# Altium project bolid.PrjPcb (part 1 of 6)
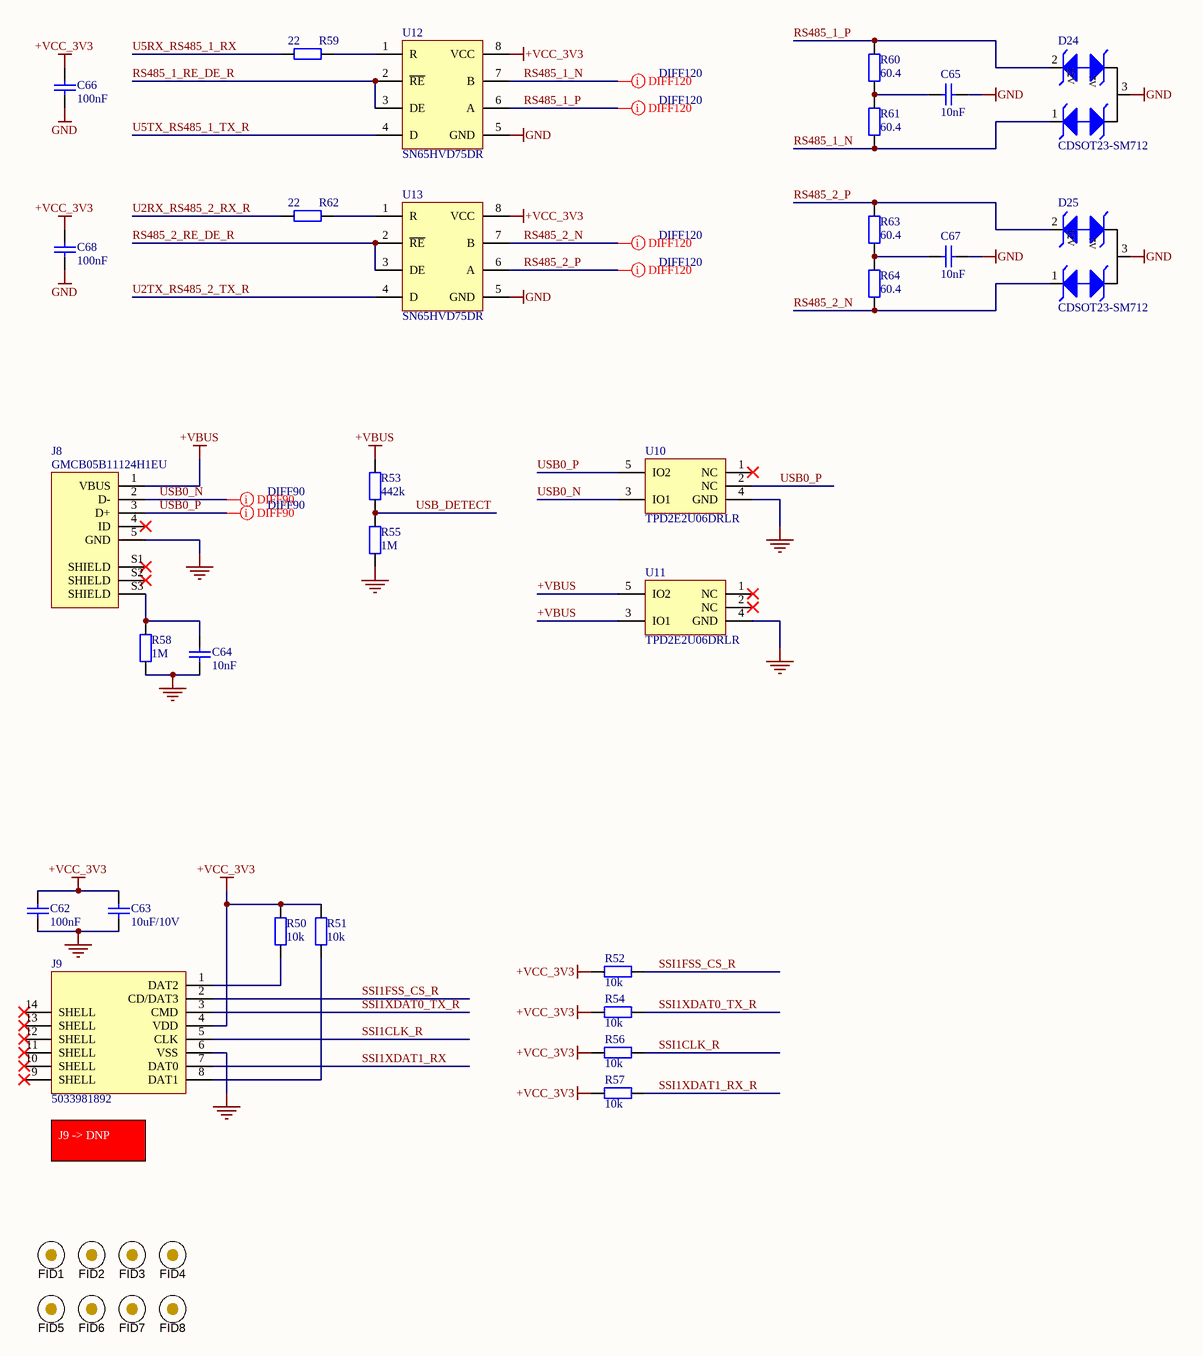
[diagram p0: bolid-rs485-usb-sd.SchDoc]
11 sheets, 459 parts. Net scope: global (net labels, ports and power ports of the same name join across sheets).
Board file: bolid.PcbDoc
Sheets:
  bolid-rs485-usb-sd.SchDoc
  bolid-inputs-lv.SchDoc
  bolid-inputs-digital.SchDoc
  bolid-inputs-hv.SchDoc
  bolid-outputs.SchDoc
  bolid-power-dcdc-ldo.SchDoc
  bolid-power-input.SchDoc
  bolid-iso-protium.SchDoc
  bolid-iso-motor-control.SchDoc
  bolid-mcu.SchDoc
  bolid-nets.SchDoc

## Sheet bolid-rs485-usb-sd.SchDoc
size A3

### Parts
C62  Value Displayed: 100nF  [C0402-CAPC100X50X55L22 - Tayio Yuden TDK]  (hidden comment: GRM155R71H104KE14D)
C63  Value Displayed: 10uF/10V  [C0805-CAPC200X125X135L50N - Taiyo YudenN]  (hidden comment: GRM21BR71A106KA73K)
C64  Value Displayed: 10nF  [C0402-CAPC100X50X55L22 - Tayio Yuden TDK]  (hidden comment: GCM155R71H103KA55D)
C65  Value Displayed: 10nF  [C0402-CAPC100X50X55L22 - Tayio Yuden TDK]  (hidden comment: GCM155R71H103KA55D)
C66  Value Displayed: 100nF  [C0402-CAPC100X50X55L22 - Tayio Yuden TDK]  (hidden comment: GRM155R71H104KE14D)
C67  Value Displayed: 10nF  [C0402-CAPC100X50X55L22 - Tayio Yuden TDK]  (hidden comment: GCM155R71H103KA55D)
C68  Value Displayed: 100nF  [C0402-CAPC100X50X55L22 - Tayio Yuden TDK]  (hidden comment: GRM155R71H104KE14D)
D24  CDSOT23-SM712  [Bourns SOT-23-3L SOT23-3P95_229X117L49X40N]
D25  CDSOT23-SM712  [Bourns SOT-23-3L SOT23-3P95_229X117L49X40N]
FID1  Fiducial  [Fiducial10-20]  (value not drawn)  (no BOM)
FID2  Fiducial  [Fiducial10-20]  (value not drawn)  (no BOM)
FID3  Fiducial  [Fiducial10-20]  (value not drawn)  (no BOM)
FID4  Fiducial  [Fiducial10-20]  (value not drawn)  (no BOM)
FID5  Fiducial  [Fiducial10-20]  (value not drawn)  (no BOM)
FID6  Fiducial  [Fiducial10-20]  (value not drawn)  (no BOM)
FID7  Fiducial  [Fiducial10-20]  (value not drawn)  (no BOM)
FID8  Fiducial  [Fiducial10-20]  (value not drawn)  (no BOM)
J8  GMCB05B11124H1EU  [AMPHENOL-GMCB05B11124H1EU]
J9  5033981892  [MOLEX MICROSD 5033981892]
R50  value 10k  [R0402-RESC100X50X40L22N]  (hidden comment: RC0402FR-0710KL)
R51  value 10k  [R0402-RESC100X50X40L22N]  (hidden comment: RC0402FR-0710KL)
R52  value 10k  [R0402-RESC100X50X40L22N]  (hidden comment: RC0402FR-0710KL)
R53  value 442k  [R0402-RESC100X50X40L22N]  (hidden comment: ERJ-2RKF4423X)
R54  value 10k  [R0402-RESC100X50X40L22N]  (hidden comment: RC0402FR-0710KL)
R55  value 1M  [R0402-RESC100X50X40L22N]  (hidden comment: AC0402FR-071ML)
R56  value 10k  [R0402-RESC100X50X40L22N]  (hidden comment: RC0402FR-0710KL)
R57  value 10k  [R0402-RESC100X50X40L22N]  (hidden comment: RC0402FR-0710KL)
R58  value 1M  [R0402-RESC100X50X40L22N]  (hidden comment: AC0402FR-071ML)
R59  value 22  [R0402-RESC100X50X40L22N]  (hidden comment: RC0402FR-1322RL)
R60  value 60.4  [R0603-RESC160X80X55L30N]  (hidden comment: RC0603FR-0760R4L)
R61  value 60.4  [R0603-RESC160X80X55L30N]  (hidden comment: RC0603FR-0760R4L)
R62  value 22  [R0402-RESC100X50X40L22N]  (hidden comment: RC0402FR-1322RL)
R63  value 60.4  [R0603-RESC160X80X55L30N]  (hidden comment: RC0603FR-0760R4L)
R64  value 60.4  [R0603-RESC160X80X55L30N]  (hidden comment: RC0603FR-0760R4L)
U10  TPD2E2U06DRLR  [TI SOT-5X3 DRL0005A SOTFL50P160X60-5N]
U11  TPD2E2U06DRLR  [TI SOT-5X3 DRL0005A SOTFL50P160X60-5N]
U12  SN65HVD75DR  [TI SOIC8 D0008A SOIC8P127_490X599X175L84X41N]
U13  SN65HVD75DR  [TI SOIC8 D0008A SOIC8P127_490X599X175L84X41N]

### Nets
+VBUS: J8.1(VBUS) R53.2 U11.3(IO1) U11.5(IO2)
+VCC_3V3: C62.2 C63.1 C66.1 C68.1 J9.4(VDD) R50.1 R51.1 R52.1 R54.1 R56.1 R57.1 U12.8(VCC) U13.8(VCC)
GND: C62.1 C63.2 C64.1 C65.2 C66.2 C67.2 C68.2 D24.3 D25.3 J8.5(GND) J9.6(VSS) R55.1 R58.1 U10.4(GND) U11.4(GND) U12.5(GND) U13.5(GND)
RS485_1_N: D24.1 R61.1 U12.7(B)
RS485_1_P: D24.2 R60.2 U12.6(A)
RS485_1_RE_DE_R: U12.2(~{RE}) U12.3(DE)
RS485_2_N: D25.1 R64.1 U13.7(B)
RS485_2_P: D25.2 R63.2 U13.6(A)
RS485_2_RE_DE_R: U13.2(~{RE}) U13.3(DE)
SSI1CLK_R: J9.5(CLK) R56.2
SSI1FSS_CS_R: J9.2(CD/DAT3) R52.2
SSI1XDAT0_TX_R: J9.3(CMD) R54.2
SSI1XDAT1_RX: J9.7(DAT0)
SSI1XDAT1_RX_R: R57.2
U2RX_RS485_2_RX_R: R62.1
U2TX_RS485_2_TX_R: U13.4(D)
U5RX_RS485_1_RX: R59.1
U5TX_RS485_1_TX_R: U12.4(D)
USB0_N: J8.2(D-) U10.3(IO1)
USB0_P: J8.3(D+) U10.2(NC) U10.5(IO2)
USB_DETECT: R53.1 R55.2
NetC64_2: C64.2 J8.S3(SHIELD) R58.2
NetC65_1: C65.1 R60.1 R61.2
NetC67_1: C67.1 R63.1 R64.2
NetJ9_1: J9.1(DAT2) R50.2
NetJ9_8: J9.8(DAT1) R51.2
NetR59_2: R59.2 U12.1(R)
NetR62_2: R62.2 U13.1(R)

Not connected (* = marked no-connect by the designer): FID1 X; FID2 X; FID3 X; FID4 X; FID5 X; FID6 X; FID7 X; FID8 X; J8 4(ID)* S1(SHIELD)* S2(SHIELD)*; J9 9(SHELL)* 10(SHELL)* 11(SHELL)* 12(SHELL)* 13(SHELL)* 14(SHELL)*; U10 1(NC)*; U11 1(NC)* 2(NC)*

### Layout directives
differential pair; differential pair class DIFF120: RS485_1_N, RS485_1_P, RS485_2_N, RS485_2_P
differential pair; differential pair class DIFF90: USB0_N, USB0_P

### Notes on the sheet
- (near J9) J9 -> DNP
- (in symbol CDSOT23-SM712) 7V

### Library data of the parts
C62 C66 C68 = GRM155R71H104KE14D: MLCC 0402 (1005) 100nF 10% 50V X7R; Manufacturer: Murata Electronics; Capacitance: 0.1 uF; Type: Chip Multilayer Ceramic Capacitor for General Purpose; Voltage Rating DC: 50 VDC; Capacitance - pF: 100000 pF; Class: Class 2; Supplier 1: Mouser; Manufacturer Part Number: GRM155R71H104KE14D; RoHS: RoHS Compliant; Category: Multilayer Ceramic Capacitors MLCC - SMD/SMT; Stock 1: 3511637; Pricing 1: 1=0.090, 10=0.038, 100=0.016, 500=0.012, 1000=0.009, 2500=0.008, 5000=0.007, 10000=0.005 (EUR); Height: 0.5 mm; Length: 1 mm; Package / Case: 0402 (1005 metric); Packaging: Cut Tape; Product: General Type MLCCs; Series: GRM; Termination Style: SMD/SMT; Tolerance: 10 %; Width: 0.5 mm; Brand: Murata Electronics; Capacitance - nF: 100 nF; Case Code - in: 0402; Case Code - mm: 1005; Dielectric: X7R; Maximum Operating Temperature: + 125 C; Minimum Operating Temperature: - 55 C; Product Type: Ceramic Capacitors; Standard Pack Qty: 10000; Subcategory: Capacitors; Termination: Standard; RoHS - Mouser: Y; Minimum Order Quantity: 1; Reeling: True; ComponentLink1URL: https://www.mouser.com/datasheet/2/281/murata_03052018_GRM_Series_1-1310166.pdf; ComponentLink1Description: https://www.mouser.com/datasheet/2/281/murata_03052018_GRM_Series_1-1310166.pdf; Value: 100nF; Supplier Part Number 1: 81-GRM155R71H104KE4D
C63 = GRM21BR71A106KA73K: MLCC 0805 (2012) 10uF 10% 10V X7R; Manufacturer: Murata Electronics; Type: Chip Multilayer Ceramic Capacitor for General Purpose; Voltage Rating DC: 10 VDC; Class: Class 2; Value: 10u; Supplier 1: Mouser; Manufacturer Part Number: GRM21BR71A106KA73K; RoHS: RoHS Compliant; Category: Multilayer Ceramic Capacitors MLCC - SMD/SMT; Stock 1: 108729; Pricing 1: 1=0.207, 10=0.144, 100=0.072, 500=0.050, 1000=0.043, 2500=0.040, 5000=0.036, 10000=0.030, 20000=0.028 (EUR); Capacitance: 10 uF; Height: 1.25 mm; Length: 2 mm; Package / Case: 0805 (2012 metric); Packaging: Cut Tape; Product: General Type MLCCs; Series: GRM; Termination Style: SMD/SMT; Tolerance: 10 %; Width: 1.25 mm; Brand: Murata Electronics; Case Code - in: 0805; Case Code - mm: 2012; Dielectric: X7R; Maximum Operating Temperature: + 125 C; Minimum Operating Temperature: - 55 C; Product Type: Ceramic Capacitors; Standard Pack Qty: 10000; Subcategory: Capacitors; Termination: Standard; RoHS - Mouser: Y; Minimum Order Quantity: 1; Reeling: True; ComponentLink1URL: https://www.mouser.com/datasheet/2/281/murata_03052018_GRM_Series_1-1310166.pdf; ComponentLink1Description: https://www.mouser.com/datasheet/2/281/murata_03052018_GRM_Series_1-1310166.pdf; Supplier Part Number 1: 81-GRM21BR71A106KA3K
C64 C65 C67 = GCM155R71H103KA55D: MLCC 0402 (1005) 10nF 10% 50V X7R; Manufacturer: Murata Electronics; Capacitance: 0.01 uF; Type: Chip Multilayer Ceramic Capacitors for Automotive; Voltage Rating DC: 50 VDC; Capacitance - pF: 10000 pF; Class: Class 2; Qualification: AEC-Q200; Value: 10n; Supplier 1: Mouser; Manufacturer Part Number: GCM155R71H103KA55D; RoHS: RoHS Compliant; Category: Multilayer Ceramic Capacitors MLCC - SMD/SMT; Stock 1: 7174893; Pricing 1: 1=0.090, 10=0.033, 100=0.015, 500=0.011, 1000=0.009, 2500=0.008, 5000=0.006, 10000=0.005, 20000=0.004 (EUR); Height: 0.5 mm; Length: 1 mm; Package / Case: 0402 (1005 metric); Packaging: Cut Tape; Product: Automotive MLCCs; Series: GCM; Termination Style: SMD/SMT; Tolerance: 10 %; Width: 0.5 mm; Brand: Murata Electronics; Capacitance - nF: 10 nF; Case Code - in: 0402; Case Code - mm: 1005; Dielectric: X7R; Maximum Operating Temperature: + 125 C; Minimum Operating Temperature: - 55 C; Product Type: Ceramic Capacitors; Standard Pack Qty: 10000; Subcategory: Capacitors; Termination: Standard; RoHS - Mouser: Y; Minimum Order Quantity: 1; Reeling: True; ComponentLink1URL: https://www.mouser.com/datasheet/2/281/murata_03122018_GCM_Series-1310150.pdf; ComponentLink1Description: https://www.mouser.com/datasheet/2/281/murata_03122018_GCM_Series-1310150.pdf; Supplier Part Number 1: 81-GCM155R71H103KA5D
D24 D25 = CDSOT23-SM712: TVS DIODE 7VWM/12VWM SOT23; Manufacturer: Bourns; Direction: Bidirectional; Capacitance: 75pF; Max Surge Current: 30A; Number of Elements: 2; Reverse Breakdown Voltage: 13.3V; Polarity: Bidirectional,Unidirectional; Clamping Voltage: 19V; Max Power Dissipation: 600W; Working Voltage: 12V; Peak Pulse Power: 400W; Power Line Protection: No; Leakage Current: 20uA; ESD Protection: Yes; Peak Pulse Current: 17A; Test Current: 1mA; Element Configuration: Dual; Diode Type: ZENER; Supplier 1: Mouser; Manufacturer Part Number: CDSOT23-SM712; RoHS: Yes; Category: TVS Diodes; Stock 1: 1112; Pricing 1: 1=1,63000, 10=1,44000, 50=1,44000, 100=1,14000, 250=1,11000, 500=0,94100, 1000=0,74300, 3000=0,69300, 6000=0,67500, 9000=0,62900, 10000=0,62900 (USD); Mount: Surface Mount; Case/Package: SOT-23; Number of Pins: 3; Contact Plating: Tin; Min Operating Temperature: -55°C; Max Operating Temperature: 150°C; Packaging: Tape and Reel; Package Quantity: 1; Number of Channels: 2; Breakdown Voltage: 13.3V; Termination: SMD/SMT; Number of Bidirectional Channels: 2; Reverse Standoff Voltage: 12V; Min Breakdown Voltage: 13.3V; Power Dissipation: 400W; Max Reverse Leakage Current: 20uA; Max Breakdown Voltage: 13.3V; Resistor Type: Zener; Series: -; Length: 3.04mm; Width: 0.055inch; Height: 1.11mm; Depth: 1.4mm; Radiation Hardening: No; REACH SVHC: No SVHC; RoHS Compliant: Yes; ComponentLink1URL: https://datasheet.ciiva.com/1281/1670933-1281331.pdf?src-supplier=Farnell; ComponentLink1Description: https://datasheet.ciiva.com/1281/1670933-1281331.pdf?src-supplier=Farnell; ComponentLink2URL: https://datasheet.ciiva.com/4510/cdsot23-sm712-25932-4510261.pdf?src-supplier=Mouser; ComponentLink2Description: https://datasheet.ciiva.com/4510/cdsot23-sm712-25932-4510261.pdf?src-supplier=Mouser; ComponentLink3URL: https://datasheet.ciiva.com/11193/cdsot23-sm712-11193846.pdf?src-supplier=Avnet; ComponentLink3Description: https://datasheet.ciiva.com/11193/cdsot23-sm712-11193846.pdf?src-supplier=Avnet; ComponentLink4URL: https://datasheet.ciiva.com/22696/1670933-22696779.pdf?src-supplier=Element14; ComponentLink4Description: https://datasheet.ciiva.com/22696/1670933-22696779.pdf?src-supplier=Element14; ComponentLink5URL: https://datasheet.ciiva.com/26828/getdatasheetpartid-418501-26828522.pdf?src-supplier=Verical; ComponentLink5Description: https://datasheet.ciiva.com/26828/getdatasheetpartid-418501-26828522.pdf?src-supplier=Verical; ComponentLink6URL: https://datasheet.ciiva.com/337/cdsot23-sm712-337451.pdf?src-supplier=Digi-Key; ComponentLink6Description: https://datasheet.ciiva.com/337/cdsot23-sm712-337451.pdf?src-supplier=Digi-Key; ComponentLink7URL: https://datasheet.ciiva.com/337/cdsot23-sm712-337452.pdf?src-supplier=Digi-Key; ComponentLink7Description: https://datasheet.ciiva.com/337/cdsot23-sm712-337452.pdf?src-supplier=Digi-Key; Supplier Part Number 1: 652-CDSOT23-SM712
FID1-FID8 = Fiducial: Fiducial mark on PCB
J8 = GMCB05B11124H1EU: Micro USB 2.0 Type B Receptacle Vertical SMT Shell Dip Length 1.7mm, Tape and Reel Packagin; Manufacturer: Amphenol; Supplier 1: Mouser; Manufacturer Part Number: GMCB05B11124H1EU; RoHS: No; Category: Connectors; Stock 1: 17853; Pricing 1: 1=1,01, 10=0,773, 50=0,641, 100=0,592, 1000=0,483, 10000=0,47 (USD); Supplier Part Number 1: 523-GMCB05B11124H1EU
J9 = 5033981892: 1.10mm Pitch microSD Memory Card Connector, Normal Mount Surface Mount, Push-Push Type, 1.28mm Height; Manufacturer: Molex; Plating: 154ConductorMaterial; Current Rating: 500mA; Voltage Rating (AC): 10V; Number of Contacts: 8; Gender: Male; Memory Type: 4498,11064MemoryType; Pitch: 1.1mm; Supplier 1: Mouser; Manufacturer Part Number: 5033981892; RoHS: Yes; Category: Memory Connectors; Stock 1: 16315; Pricing 1: 1=2,97, 10=1,94, 50=1,94, 100=1,68, 1000=1,5, 10000=1,35 (USD); Mount: Surface Mount; Contact Material: Bronze,Stainless Steel; Contact Plating: Gold; Housing Material: Thermoplastic; Min Operating Temperature: -25°C; Max Operating Temperature: 85°C; Packaging: Tape and Reel; Number of Rows: 1; Package Quantity: 2400; Termination: Solder; Orientation: Right Angle; Number of Circuits: 8; Series: 503398; Voltage Rating: 10V; Length: 13.6mm; Width: 14.05mm; Depth: 14.05mm; Halogen Free: Low Halogen; RoHS Compliant: Yes; Reach SVHC Compliant: Unknown; ComponentLink1URL: https://datasheet.ciiva.com/23941/1740947-23941665.pdf?src-supplier=Newark; ComponentLink1Description: https://datasheet.ciiva.com/23941/1740947-23941665.pdf?src-supplier=Newark; ComponentLink2URL: https://datasheet.ciiva.com/22744/1740946-22744573.pdf?src-supplier=Element14; ComponentLink2Description: https://datasheet.ciiva.com/22744/1740946-22744573.pdf?src-supplier=Element14; Supplier Part Number 1: 538-503398-1892
R50-R52 R54 R56 R57 = RC0402FR-0710KL: RES 0402 (1005) 10.0k 1% 0.0625W 50V Thick Film; Manufacturer: Yageo; Power Rating: 62.5 mW, 125 mW; Resistance: 10 kOhms; Temperature Coefficient: 100 PPM / C; Supplier 1: Mouser; Manufacturer Part Number: RC0402FR-0710KL; RoHS: RoHS Compliant; Category: Thick Film Resistors - SMD; Stock 1: 20942447; Pricing 1: 1=0.090, 10=0.011, 100=0.004, 1000=0.003, 10000=0.003 (EUR); Application: High Reliability; Features: -; Height: 0.35 mm; Length: 1 mm; Package / Case: -; Packaging: Cut Tape; Product: Thick Film Resistors SMD; Series: RC; Technology: Thick Film; Termination Style: SMD/SMT; Tolerance: 1 %; Type: General Purpose; Voltage Rating: 50 V; Width: 0.5 mm; Brand: Yageo; Mounting Style: PCB Mount; Case Code - in: 0402; Case Code - mm: 1005; Maximum Operating Temperature: + 155 C; Minimum Operating Temperature: - 55 C; Product Type: Thick Film Resistors; Standard Pack Qty: 10000; Subcategory: Resistors; RoHS - Mouser: Y; Minimum Order Quantity: 1; Reeling: True; ComponentLink1URL: https://www.mouser.com/datasheet/2/447/PYu-RC_Group_51_RoHS_L_10-1664068.pdf; ComponentLink1Description: https://www.mouser.com/datasheet/2/447/PYu-RC_Group_51_RoHS_L_10-1664068.pdf; Supplier Part Number 1: 603-RC0402FR-0710KL
R53 = ERJ-2RKF4423X: RES 0402 (1005) 442.0k 1% 0.100W 50V Thick Film; Manufacturer: Panasonic; Power Rating: 100 mW (1/10 W); Resistance: 442 kOhms; Temperature Coefficient: 100 PPM / C; Qualification: AEC-Q200; Supplier 1: Mouser; Manufacturer Part Number: ERJ-2RKF4423X; RoHS: RoHS Compliant By Exemption; Category: Thick Film Resistors - SMD; Stock 1: 56067; Pricing 1: 1=0.085, 10=0.025, 100=0.010, 1000=0.005, 2500=0.004, 5000=0.003, 10000=0.003 (EUR); Application: Automotive Grade; Features: Precision Resistors; Height: 0.35 mm; Length: 1 mm; Packaging: Cut Tape; Product: Thick Film Resistors SMD; Series: ERJ-2Rx; Technology: Thick Film; Termination Style: SMD/SMT; Tolerance: 1 %; Voltage Rating: 50 V; Width: 0.5 mm; Brand: Panasonic; Mounting Style: PCB Mount; Case Code - in: 0402; Case Code - mm: 1005; Maximum Operating Temperature: + 155 C; Minimum Operating Temperature: - 55 C; Product Type: Thick Film Resistors; Standard Pack Qty: 10000; Subcategory: Resistors; RoHS - Mouser: E; Minimum Order Quantity: 1; Reeling: True; ComponentLink1URL: https://www.mouser.com/datasheet/2/315/AOA0000C304-1149620.pdf; ComponentLink1Description: https://www.mouser.com/datasheet/2/315/AOA0000C304-1149620.pdf; Supplier Part Number 1: 667-ERJ-2RKF4423X
R55 R58 = AC0402FR-071ML: RES 0402 (1005) 1.00M 1% 0.0625W 50V Thick Film; Manufacturer: YAGEO; Power Rating: 62.5 mW (1/16 W); Resistance: 1 MOhms; Temperature Coefficient: 100 PPM / C; Qualification: AEC-Q200; Supplier 1: Mouser; Manufacturer Part Number: AC0402FR-071ML; RoHS: RoHS Compliant By Exemption; Category: Thick Film Resistors - SMD; Stock 1: 142366; Pricing 1: 1=0.085, 10=0.019, 100=0.008, 1000=0.004, 2500=0.003, 10000=0.003 (EUR); Application: Automotive Grade; Height: 0.32 mm; Length: 1 mm; Packaging: Cut Tape; Product: Thick Film Resistors General Purpose; Series: AC; Technology: Thick Film; Termination Style: SMD/SMT; Tolerance: 1 %; Type: General Purpose Resistor; Voltage Rating: 50 V; Width: 0.5 mm; Brand: YAGEO; Mounting Style: PCB Mount; Case Code - in: 0402; Case Code - mm: 1005; Maximum Operating Temperature: + 155 C; Minimum Operating Temperature: - 55 C; Product Type: Thick Film Resistors; Standard Pack Qty: 10000; Subcategory: Resistors; RoHS - Mouser: E; Minimum Order Quantity: 1; Reeling: True; ComponentLink1URL: https://www.mouser.com/datasheet/2/447/Yageo_PYu_AC_51_RoHS_L_7_1714230-1874691.pdf; ComponentLink1Description: https://www.mouser.com/datasheet/2/447/Yageo_PYu_AC_51_RoHS_L_7_1714230-1874691.pdf; Supplier Part Number 1: 603-AC0402FR-071ML
R59 R62 = RC0402FR-1322RL: RES 0402 (1005) 22.0 ohm 1% 0.0625W 50V Thick Film; Manufacturer: Yageo; Resistance: 22R; Power Rating: 62.5mW; Temperature Coefficient: 100ppm/°C; Supplier 1: Mouser; Manufacturer Part Number: RC0402FR-1322RL; RoHS: Yes; Category: Chip SMD Resistors; Stock 1: 130563; Pricing 1: 1=0,10000, 10=0,01200, 50=0,01200, 100=0,00500, 1000=0,00300, 10000=0,00300 (USD); Case/Package: 0402; Case Code (Imperial): 0402; Case Code (Metric): 1005; Weight: 2.3E-05oz; Contact Plating: Tin,Matte; Size Code: 0402; Min Operating Temperature: -55°C; Max Operating Temperature: 155°C; Voltage Rating: 50V; Tolerance: 1%; Packaging: Tape and Reel; Resistor Type: Thick Film; Termination: SMD/SMT; Series: RC; Length: 1mm; Width: 0.5mm; Height: 0.35mm; Radiation Hardening: No; Lead Free: Lead Free; RoHS Compliant: Yes; ComponentLink1URL: https://datasheet.ciiva.com/17423/pyu-rc0402-51-rohs-l-6-r-17423721.pdf?src-supplier=Future+Electronics; ComponentLink1Description: https://datasheet.ciiva.com/17423/pyu-rc0402-51-rohs-l-6-r-17423721.pdf?src-supplier=Future+Electronics; ComponentLink2URL: https://datasheet.ciiva.com/8890/pyu-rc0402-51-rohs-l-6-8890187.pdf?src-supplier=Avnet; ComponentLink2Description: https://datasheet.ciiva.com/8890/pyu-rc0402-51-rohs-l-6-8890187.pdf?src-supplier=Avnet; Supplier Part Number 1: 603-RC0402FR-1322RL
R60 R61 R63 R64 = RC0603FR-0760R4L: RES 0603 (1608) 60.4 ohm 1% 0.100W 75V Thick Film; Manufacturer: Yageo; Power Rating: 100 mW (1/10 W); Resistance: 60.4 Ohms; Temperature Coefficient: 100 PPM / C; Supplier 1: Mouser; Manufacturer Part Number: RC0603FR-0760R4L; RoHS: RoHS Compliant By Exemption; Category: Thick Film Resistors - SMD; Stock 1: 301644; Pricing 1: 1=0.090, 10=0.016, 100=0.005, 5000=0.003 (EUR); Application: High Reliability; Features: -; Height: 0.45 mm; Length: 1.6 mm; Package / Case: -; Packaging: Cut Tape; Product: Thick Film Resistors SMD; Series: RC; Technology: Thick Film; Termination Style: SMD/SMT; Tolerance: 1 %; Type: General Purpose; Voltage Rating: 75 V; Width: 0.8 mm; Brand: Yageo; Mounting Style: PCB Mount; Case Code - in: 0603; Case Code - mm: 1608; Maximum Operating Temperature: + 155 C; Minimum Operating Temperature: - 55 C; Product Type: Thick Film Resistors; Standard Pack Qty: 5000; Subcategory: Resistors; RoHS - Mouser: E; Minimum Order Quantity: 1; Reeling: True; ComponentLink1URL: https://www.mouser.com/datasheet/2/447/PYu-RC_Group_51_RoHS_L_10-1664068.pdf; ComponentLink1Description: https://www.mouser.com/datasheet/2/447/PYu-RC_Group_51_RoHS_L_10-1664068.pdf; Supplier Part Number 1: 603-RC0603FR-0760R4L
U10 U11 = TPD2E2U06DRLR: TVS DIODE 5.5VWM 12.4VC 5SOT; Manufacturer: Texas Instruments; Direction: Unidirectional; Capacitance: 1.9pF; Reverse Standoff Voltage: 5.5V; Min Breakdown Voltage: 6.5V; Clamping Voltage: 12.4V; Peak Pulse Power: 85W; Power Line Protection: Yes; Breakdown Voltage: 8.5V; Peak Pulse Current: 5.5A; Number of Channels: 2; Interface: LVDS,USB,Ethernet; Supplier 1: Mouser; Manufacturer Part Number: TPD2E2U06DRLR; RoHS: Yes; Category: Integrated Circuits (ICs); Stock 1: 73856; Pricing 1: 1=0,49, 10=0,356, 50=0,356, 100=0,254, 1000=0,173, 10000=0,159 (USD); Mount: Surface Mount; Case/Package: SOT-5; Number of Pins: 5; Min Operating Temperature: -40°C; Max Operating Temperature: 125°C; Packaging: Tape and Reel; Working Voltage: 5.5V; Polarity: Unidirectional; Termination: SMD/SMT; Package Quantity: 4000; Series: -; Operating Supply Voltage: 5.5V; Number of Unidirectional Channels: 2; Lead Free: Lead Free; RoHS Compliant: Yes; Reach SVHC Compliant: No; ComponentLink1URL: https://datasheet.ciiva.com/48533/tpd2e2u06-48533343.pdf?src-supplier=Avnet; ComponentLink1Description: https://datasheet.ciiva.com/48533/tpd2e2u06-48533343.pdf?src-supplier=Avnet; Supplier Part Number 1: 595-TPD2E2U06DRLR
U12 U13 = SN65HVD75DR: IC TXRX RS485 3.3V LP 8SOIC; Manufacturer: Texas Instruments; Nominal Supply Current: 950uA; Number of Receivers: 1; Data Rate: 20Mbps; Logic Function: Transceiver; Simplex/Duplex: Half Duplex; Receiver Hysteresis: 80mV; Min Supply Voltage: 3V; Max Supply Voltage: 3.6V; Interface: RS-422,RS-485; Supplier 1: Mouser; Manufacturer Part Number: SN65HVD75DR; RoHS: Yes; Category: RS-232 / RS-422 / RS-485 Interface ICs; Pricing 1: 1=3,10000, 10=2,79000, 25=2,63000, 50=2,63000, 100=2,28000, 250=2,17000, 500=1,94000, 1000=1,70000, 2500=1,69000, 10000=1,69000 (USD); Case/Package: D; Number of Pins: 8; Contact Plating: Gold; Min Operating Temperature: -40°C; Max Operating Temperature: 125°C; Package Quantity: 2500; Operating Supply Voltage: 3.3V; Packaging: Tape and Reel; Number of Drivers: 1; Series: -; Supply Current: 950uA; Number of Transmitters: 1; Number of Transceivers: 1; Radiation Hardening: No; Lead Free: Lead Free; RoHS Compliant: Yes; REACH SVHC: No SVHC; ComponentLink2URL: https://datasheet.ciiva.com/26946/getdatasheetpartid-520468-26946072.pdf?src-supplier=Verical; ComponentLink2Description: https://datasheet.ciiva.com/26946/getdatasheetpartid-520468-26946072.pdf?src-supplier=Verical; ComponentLink3URL: https://datasheet.ciiva.com/14195/sn65hvd75-14195222.pdf?src-supplier=Avnet; ComponentLink3Description: https://datasheet.ciiva.com/14195/sn65hvd75-14195222.pdf?src-supplier=Avnet; ComponentLink4URL: https://datasheet.ciiva.com/6635/sn65hvd75-6635111.pdf?src-supplier=Digi-Key; ComponentLink4Description: https://datasheet.ciiva.com/6635/sn65hvd75-6635111.pdf?src-supplier=Digi-Key; Supplier Part Number 1: 595-SN65HVD75DR

## Sheet bolid-inputs-lv.SchDoc
size A3
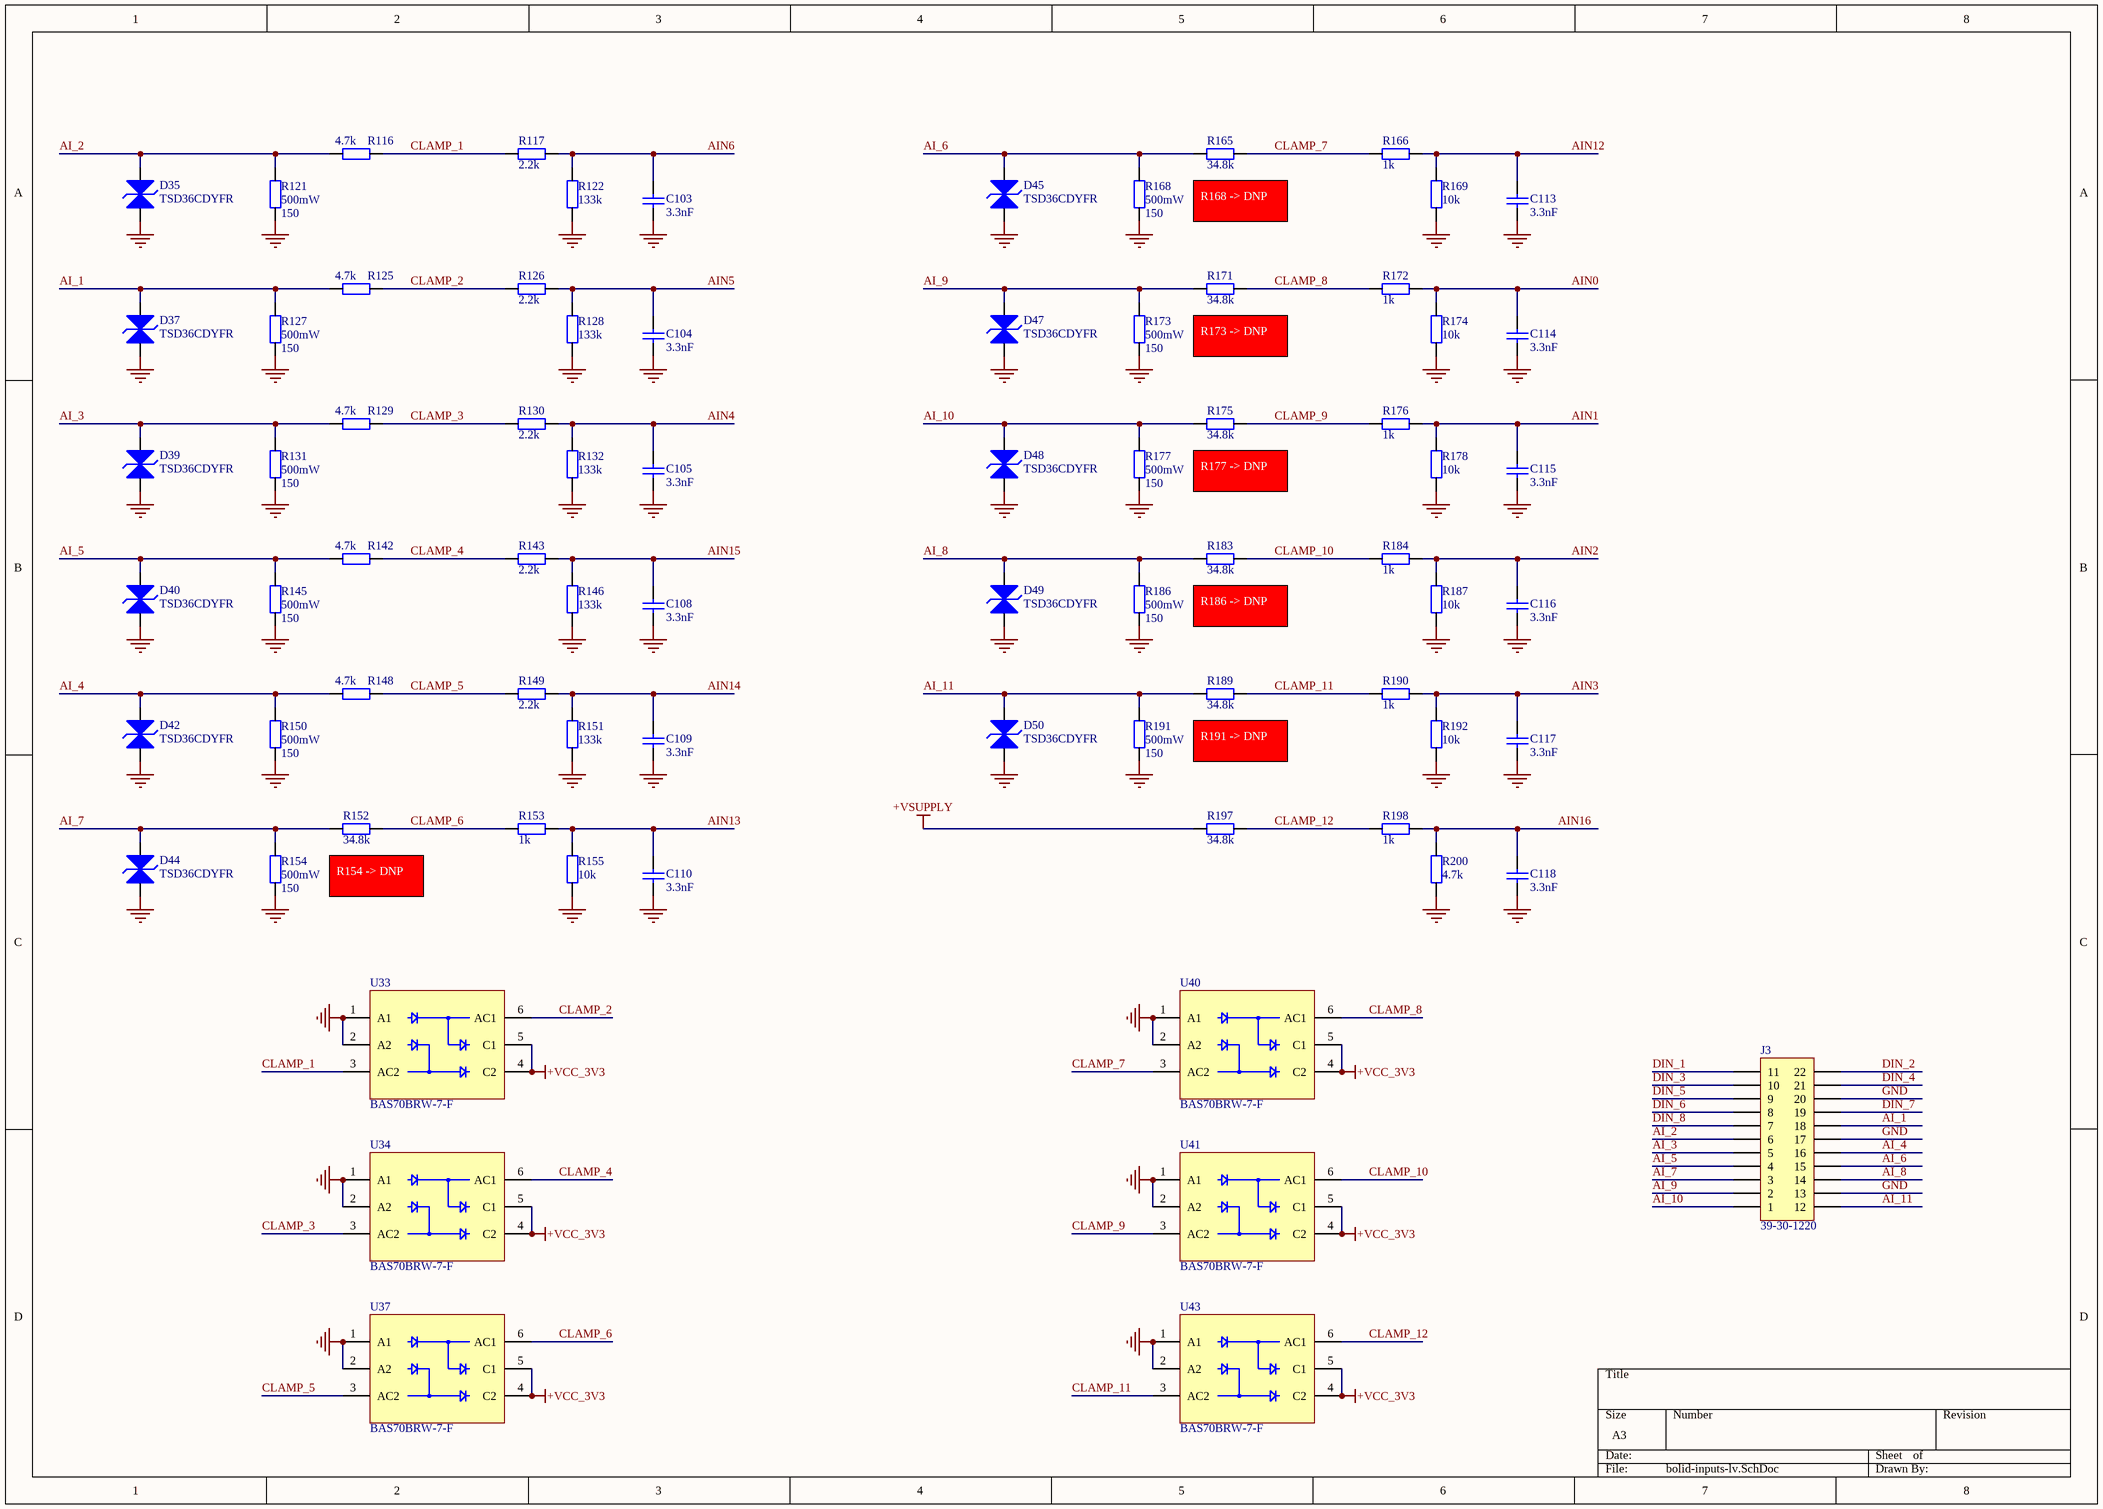
[diagram p1: bolid-inputs-lv.SchDoc]

### Parts
C103  Value Displayed: 3.3nF  [C0402-CAPC100X50X55L22 - Tayio Yuden TDK]  (hidden comment: GRM155R71H332JA01J)
C104  Value Displayed: 3.3nF  [C0402-CAPC100X50X55L22 - Tayio Yuden TDK]  (hidden comment: GRM155R71H332JA01J)
C105  Value Displayed: 3.3nF  [C0402-CAPC100X50X55L22 - Tayio Yuden TDK]  (hidden comment: GRM155R71H332JA01J)
C108  Value Displayed: 3.3nF  [C0402-CAPC100X50X55L22 - Tayio Yuden TDK]  (hidden comment: GRM155R71H332JA01J)
C109  Value Displayed: 3.3nF  [C0402-CAPC100X50X55L22 - Tayio Yuden TDK]  (hidden comment: GRM155R71H332JA01J)
C110  Value Displayed: 3.3nF  [C0402-CAPC100X50X55L22 - Tayio Yuden TDK]  (hidden comment: GRM155R71H332JA01J)
C113  Value Displayed: 3.3nF  [C0402-CAPC100X50X55L22 - Tayio Yuden TDK]  (hidden comment: GRM155R71H332JA01J)
C114  Value Displayed: 3.3nF  [C0402-CAPC100X50X55L22 - Tayio Yuden TDK]  (hidden comment: GRM155R71H332JA01J)
C115  Value Displayed: 3.3nF  [C0402-CAPC100X50X55L22 - Tayio Yuden TDK]  (hidden comment: GRM155R71H332JA01J)
C116  Value Displayed: 3.3nF  [C0402-CAPC100X50X55L22 - Tayio Yuden TDK]  (hidden comment: GRM155R71H332JA01J)
C117  Value Displayed: 3.3nF  [C0402-CAPC100X50X55L22 - Tayio Yuden TDK]  (hidden comment: GRM155R71H332JA01J)
C118  Value Displayed: 3.3nF  [C0402-CAPC100X50X55L22 - Tayio Yuden TDK]  (hidden comment: GRM155R71H332JA01J)
D35  TSD36CDYFR  [SOD-323 DYF0002A TI - BIDIRECTIONAL]
D37  TSD36CDYFR  [SOD-323 DYF0002A TI - BIDIRECTIONAL]
D39  TSD36CDYFR  [SOD-323 DYF0002A TI - BIDIRECTIONAL]
D40  TSD36CDYFR  [SOD-323 DYF0002A TI - BIDIRECTIONAL]
D42  TSD36CDYFR  [SOD-323 DYF0002A TI - BIDIRECTIONAL]
D44  TSD36CDYFR  [SOD-323 DYF0002A TI - BIDIRECTIONAL]
D45  TSD36CDYFR  [SOD-323 DYF0002A TI - BIDIRECTIONAL]
D47  TSD36CDYFR  [SOD-323 DYF0002A TI - BIDIRECTIONAL]
D48  TSD36CDYFR  [SOD-323 DYF0002A TI - BIDIRECTIONAL]
D49  TSD36CDYFR  [SOD-323 DYF0002A TI - BIDIRECTIONAL]
D50  TSD36CDYFR  [SOD-323 DYF0002A TI - BIDIRECTIONAL]
J3  39-30-1220  [MOLEX Mini-Fit Jr 039301220 2x11 Peg]
R116  value 4.7k  [R0402-RESC100X50X40L22N]  (hidden comment: RC0402FR-074K7L)
R117  value 2.2k  [R0402-RESC100X50X40L22N]  (hidden comment: RC0402FR-072K2L)
R121  value 150  Power Rating: 500mW  [R1210-RESC3126X06N - Yageo]  (hidden comment: RC1210FR-07150RL)
R122  value 133k  [R0402-RESC100X50X40L22N]  (hidden comment: RC0402FR-07133KL)
R125  value 4.7k  [R0402-RESC100X50X40L22N]  (hidden comment: RC0402FR-074K7L)
R126  value 2.2k  [R0402-RESC100X50X40L22N]  (hidden comment: RC0402FR-072K2L)
R127  value 150  Power Rating: 500mW  [R1210-RESC3126X06N - Yageo]  (hidden comment: RC1210FR-07150RL)
R128  value 133k  [R0402-RESC100X50X40L22N]  (hidden comment: RC0402FR-07133KL)
R129  value 4.7k  [R0402-RESC100X50X40L22N]  (hidden comment: RC0402FR-074K7L)
R130  value 2.2k  [R0402-RESC100X50X40L22N]  (hidden comment: RC0402FR-072K2L)
R131  value 150  Power Rating: 500mW  [R1210-RESC3126X06N - Yageo]  (hidden comment: RC1210FR-07150RL)
R132  value 133k  [R0402-RESC100X50X40L22N]  (hidden comment: RC0402FR-07133KL)
R142  value 4.7k  [R0402-RESC100X50X40L22N]  (hidden comment: RC0402FR-074K7L)
R143  value 2.2k  [R0402-RESC100X50X40L22N]  (hidden comment: RC0402FR-072K2L)
R145  value 150  Power Rating: 500mW  [R1210-RESC3126X06N - Yageo]  (hidden comment: RC1210FR-07150RL)
R146  value 133k  [R0402-RESC100X50X40L22N]  (hidden comment: RC0402FR-07133KL)
R148  value 4.7k  [R0402-RESC100X50X40L22N]  (hidden comment: RC0402FR-074K7L)
R149  value 2.2k  [R0402-RESC100X50X40L22N]  (hidden comment: RC0402FR-072K2L)
R150  value 150  Power Rating: 500mW  [R1210-RESC3126X06N - Yageo]  (hidden comment: RC1210FR-07150RL)
R151  value 133k  [R0402-RESC100X50X40L22N]  (hidden comment: RC0402FR-07133KL)
R152  value 34.8k  [R0402-RESC100X50X40L22N]  (hidden comment: RC0402FR-0734K8L)
R153  value 1k  [R0402-RESC100X50X40L22N]  (hidden comment: RC0402FR-071KL)
R154  value 150  Power Rating: 500mW  [R1210-RESC3126X06N - Yageo]  (hidden comment: RC1210FR-07150RL)
R155  value 10k  [R0402-RESC100X50X40L22N]  (hidden comment: RC0402FR-0710KL)
R165  value 34.8k  [R0402-RESC100X50X40L22N]  (hidden comment: RC0402FR-0734K8L)
R166  value 1k  [R0402-RESC100X50X40L22N]  (hidden comment: RC0402FR-071KL)
R168  value 150  Power Rating: 500mW  [R1210-RESC3126X06N - Yageo]  (hidden comment: RC1210FR-07150RL)
R169  value 10k  [R0402-RESC100X50X40L22N]  (hidden comment: RC0402FR-0710KL)
R171  value 34.8k  [R0402-RESC100X50X40L22N]  (hidden comment: RC0402FR-0734K8L)
R172  value 1k  [R0402-RESC100X50X40L22N]  (hidden comment: RC0402FR-071KL)
R173  value 150  Power Rating: 500mW  [R1210-RESC3126X06N - Yageo]  (hidden comment: RC1210FR-07150RL)
R174  value 10k  [R0402-RESC100X50X40L22N]  (hidden comment: RC0402FR-0710KL)
R175  value 34.8k  [R0402-RESC100X50X40L22N]  (hidden comment: RC0402FR-0734K8L)
R176  value 1k  [R0402-RESC100X50X40L22N]  (hidden comment: RC0402FR-071KL)
R177  value 150  Power Rating: 500mW  [R1210-RESC3126X06N - Yageo]  (hidden comment: RC1210FR-07150RL)
R178  value 10k  [R0402-RESC100X50X40L22N]  (hidden comment: RC0402FR-0710KL)
R183  value 34.8k  [R0402-RESC100X50X40L22N]  (hidden comment: RC0402FR-0734K8L)
R184  value 1k  [R0402-RESC100X50X40L22N]  (hidden comment: RC0402FR-071KL)
R186  value 150  Power Rating: 500mW  [R1210-RESC3126X06N - Yageo]  (hidden comment: RC1210FR-07150RL)
R187  value 10k  [R0402-RESC100X50X40L22N]  (hidden comment: RC0402FR-0710KL)
R189  value 34.8k  [R0402-RESC100X50X40L22N]  (hidden comment: RC0402FR-0734K8L)
R190  value 1k  [R0402-RESC100X50X40L22N]  (hidden comment: RC0402FR-071KL)
R191  value 150  Power Rating: 500mW  [R1210-RESC3126X06N - Yageo]  (hidden comment: RC1210FR-07150RL)
R192  value 10k  [R0402-RESC100X50X40L22N]  (hidden comment: RC0402FR-0710KL)
R197  value 34.8k  [R0402-RESC100X50X40L22N]  (hidden comment: RC0402FR-0734K8L)
R198  value 1k  [R0402-RESC100X50X40L22N]  (hidden comment: RC0402FR-071KL)
R200  value 4.7k  [R0402-RESC100X50X40L22N]  (hidden comment: RC0402FR-074K7L)
U33  BAS70BRW-7-F  [SOT363 DIODES DS30158 Rev. 14-2 SOT65P210X110-6N]
U34  BAS70BRW-7-F  [SOT363 DIODES DS30158 Rev. 14-2 SOT65P210X110-6N]
U37  BAS70BRW-7-F  [SOT363 DIODES DS30158 Rev. 14-2 SOT65P210X110-6N]
U40  BAS70BRW-7-F  [SOT363 DIODES DS30158 Rev. 14-2 SOT65P210X110-6N]
U41  BAS70BRW-7-F  [SOT363 DIODES DS30158 Rev. 14-2 SOT65P210X110-6N]
U43  BAS70BRW-7-F  [SOT363 DIODES DS30158 Rev. 14-2 SOT65P210X110-6N]

### Nets
+VCC_3V3: U33.4(C2) U33.5(C1) U34.4(C2) U34.5(C1) U37.4(C2) U37.5(C1) U40.4(C2) U40.5(C1) U41.4(C2) U41.5(C1) U43.4(C2) U43.5(C1)
+VSUPPLY: R197.1
GND: C103.1 C104.1 C105.1 C108.1 C109.1 C110.1 C113.1 C114.1 C115.1 C116.1 C117.1 C118.1 D35.1 D37.1 D39.1 D40.1 D42.1 D44.1 D45.1 D47.1 D48.1 D49.1 D50.1 J3.13 J3.17 J3.20 R121.1 R122.1 R127.1 R128.1 R131.1 R132.1 R145.1 R146.1 R150.1 R151.1 R154.1 R155.1 R168.1 R169.1 R173.1 R174.1 R177.1 R178.1 R186.1 R187.1 R191.1 R192.1 R200.1 U33.1(A1) U33.2(A2) U34.1(A1) U34.2(A2) U37.1(A1) U37.2(A2) U40.1(A1) U40.2(A2) U41.1(A1) U41.2(A2) U43.1(A1) U43.2(A2)
AI_1: D37.2 J3.18 R125.1 R127.2
AI_2: D35.2 J3.6 R116.1 R121.2
AI_3: D39.2 J3.5 R129.1 R131.2
AI_4: D42.2 J3.16 R148.1 R150.2
AI_5: D40.2 J3.4 R142.1 R145.2
AI_6: D45.2 J3.15 R165.1 R168.2
AI_7: D44.2 J3.3 R152.1 R154.2
AI_8: D49.2 J3.14 R183.1 R186.2
AI_9: D47.2 J3.2 R171.1 R173.2
AI_10: D48.2 J3.1 R175.1 R177.2
AI_11: D50.2 J3.12 R189.1 R191.2
AIN0: C114.2 R172.2 R174.2
AIN1: C115.2 R176.2 R178.2
AIN2: C116.2 R184.2 R187.2
AIN3: C117.2 R190.2 R192.2
AIN4: C105.2 R130.1 R132.2
AIN5: C104.2 R126.1 R128.2
AIN6: C103.2 R117.1 R122.2
AIN12: C113.2 R166.2 R169.2
AIN13: C110.2 R153.2 R155.2
AIN14: C109.2 R149.1 R151.2
AIN15: C108.2 R143.1 R146.2
AIN16: C118.2 R198.2 R200.2
CLAMP_1: R116.2 R117.2 U33.3(AC2)
CLAMP_2: R125.2 R126.2 U33.6(AC1)
CLAMP_3: R129.2 R130.2 U34.3(AC2)
CLAMP_4: R142.2 R143.2 U34.6(AC1)
CLAMP_5: R148.2 R149.2 U37.3(AC2)
CLAMP_6: R152.2 R153.1 U37.6(AC1)
CLAMP_7: R165.2 R166.1 U40.3(AC2)
CLAMP_8: R171.2 R172.1 U40.6(AC1)
CLAMP_9: R175.2 R176.1 U41.3(AC2)
CLAMP_10: R183.2 R184.1 U41.6(AC1)
CLAMP_11: R189.2 R190.1 U43.3(AC2)
CLAMP_12: R197.2 R198.1 U43.6(AC1)
DIN_1: J3.11
DIN_2: J3.22
DIN_3: J3.10
DIN_4: J3.21
DIN_5: J3.9
DIN_6: J3.8
DIN_7: J3.19
DIN_8: J3.7

### Notes on the sheet
- (near R165) R168 -> DNP
- (near R171) R173 -> DNP
- (near R175) R177 -> DNP
- (near R183) R186 -> DNP
- (near R189) R191 -> DNP
- (near R152) R154 -> DNP

### Library data of the parts
C103-C105 C108-C110 C113-C118 = GRM155R71H332JA01J: MLCC 0402 (1005) 3.3nF 5% 50V X7R; Manufacturer: Murata; Value: 3.3n; Supplier 1: Mouser; Manufacturer Part Number: GRM155R71H332JA01J; RoHS: Yes; Category: Ceramic Capacitors; Stock 1: 49279; Pricing 1: 1=0,1, 10=0,022, 50=0,022, 100=0,011, 1000=0,007, 10000=0,006 (USD); Case/Package: 343Case; Voltage Rating (DC): 50V; Dielectric: X7R; Tolerance: 5%; Capacitance: 3.3nF; Length: 1mm; Width: 500um; Thickness: 500um; RoHS Compliant: Yes; Supplier Part Number 1: 81-GRM155R71H332JA1J
D35 D37 D39 D40 D42 D44 D45 D47-D50 = TSD36CDYFR: 36V bidirectional surge protection diode in SOD323 package 2-SOT -55 to 150; Manufacturer: Texas Instruments; Supplier 1: Mouser; Manufacturer Part Number: TSD36CDYFR; RoHS: No; Stock 1: 6000; Pricing 1: 1=0,4, 10=0,29, 50=0,29, 100=0,146, 1000=0,1, 10000=0,078 (USD); Case/Package: SOT; Number of Pins: 2; Length: 1.3mm; Width: 1.7mm; Thickness: 850um; Supplier Part Number 1: 595-TSD36CDYFR
J3 = 039301220: Molex MiniFit Jr 2x11 Peg Conn Power HDR 22 POS 4.2mm Solder RA Thru-Hole 22 Terminal 1 Port Bag; Supplier 1: Mouser; Manufacturer: Molex; Manufacturer Part Number: 39-30-1220; RoHS: Yes; Category: Headers and Wire Housings; Stock 1: 554; Pricing 1: 1=3,28, 10=2,69, 50=2,69, 100=2,29, 1000=2,16, 10000=2,15 (USD); ComponentLink1URL: https://datasheet.ciiva.com/5149/0039301220-pcb-headers-160144-5149966.pdf?src-supplier=Mouser; ComponentLink1Description: https://datasheet.ciiva.com/5149/0039301220-pcb-headers-160144-5149966.pdf?src-supplier=Mouser; ComponentLink2URL: https://datasheet.ciiva.com/11750/0900766b805f2c40-11750460.pdf?src-supplier=Rs; ComponentLink2Description: https://datasheet.ciiva.com/11750/0900766b805f2c40-11750460.pdf?src-supplier=Rs; ComponentLink3URL: https://datasheet.ciiva.com/1443/1775068-1443200.pdf?src-supplier=Element14; ComponentLink3Description: https://datasheet.ciiva.com/1443/1775068-1443200.pdf?src-supplier=Element14; ComponentLink4URL: https://datasheet.ciiva.com/30171/97700039301220-pcb-headers-30171274.pdf?src-supplier=Onlinecomponents.com; ComponentLink4Description: https://datasheet.ciiva.com/30171/97700039301220-pcb-headers-30171274.pdf?src-supplier=Onlinecomponents.com; ComponentLink5URL: https://datasheet.ciiva.com/49273/304186-49273820.pdf?src-supplier=Jameco; ComponentLink5Description: https://datasheet.ciiva.com/49273/304186-49273820.pdf?src-supplier=Jameco; ComponentLink6URL: https://datasheet.ciiva.com/1451/1775068-1451585.pdf?src-supplier=Farnell; ComponentLink6Description: https://datasheet.ciiva.com/1451/1775068-1451585.pdf?src-supplier=Farnell; Supplier Part Number 1: 538-39-30-1220
R116 R125 R129 R142 R148 R200 = RC0402FR-074K7L: RES 0402 (1005) 4.70k 1% 0.063W 50V Thick Film; Manufacturer: Yageo; Power Rating: 62.5 mW (1/16 W); Resistance: 4.7 kOhms; Temperature Coefficient: 100 PPM / C; Supplier 1: Mouser; Manufacturer Part Number: RC0402FR-074K7L; RoHS: RoHS Compliant By Exemption; Category: Thick Film Resistors - SMD; Stock 1: 1586127; Pricing 1: 1=0.090, 10=0.011, 100=0.004, 1000=0.003, 10000=0.003 (EUR); Application: High Reliability; Features: -; Height: 0.35 mm; Length: 1 mm; Package / Case: -; Packaging: Cut Tape; Product: Thick Film Resistors SMD; Series: RC; Technology: Thick Film; Termination Style: SMD/SMT; Tolerance: 1 %; Type: General Purpose; Voltage Rating: 50 V; Width: 0.5 mm; Brand: Yageo; Mounting Style: PCB Mount; Case Code - in: 0402; Case Code - mm: 1005; Maximum Operating Temperature: + 155 C; Minimum Operating Temperature: - 55 C; Product Type: Thick Film Resistors; Standard Pack Qty: 10000; Subcategory: Resistors; RoHS - Mouser: E; Minimum Order Quantity: 1; Reeling: True; ComponentLink1URL: https://www.mouser.com/datasheet/2/447/PYu-RC_Group_51_RoHS_L_10-1664068.pdf; ComponentLink1Description: https://www.mouser.com/datasheet/2/447/PYu-RC_Group_51_RoHS_L_10-1664068.pdf; Supplier Part Number 1: 603-RC0402FR-074K7L
R117 R126 R130 R143 R149 = RC0402FR-072K2L: RES 0402 (1005) 2.20k 1% 0.0625W 50V Thick Film; Manufacturer: Yageo; Power Rating: 62.5 mW, 125 mW; Resistance: 2.2 kOhms; Temperature Coefficient: 100 PPM / C; Supplier 1: Mouser; Manufacturer Part Number: RC0402FR-072K2L; RoHS: RoHS Compliant By Exemption; Category: Thick Film Resistors - SMD; Stock 1: 1394386; Pricing 1: 1=0.090, 10=0.011, 100=0.004, 1000=0.003, 10000=0.003 (EUR); Application: High Reliability; Features: -; Height: 0.35 mm; Length: 1 mm; Package / Case: -; Packaging: Cut Tape; Product: Thick Film Resistors SMD; Series: RC; Technology: Thick Film; Termination Style: SMD/SMT; Tolerance: 1 %; Type: General Purpose; Voltage Rating: 50 V; Width: 0.5 mm; Brand: Yageo; Mounting Style: PCB Mount; Case Code - in: 0402; Case Code - mm: 1005; Maximum Operating Temperature: + 155 C; Minimum Operating Temperature: - 55 C; Product Type: Thick Film Resistors; Standard Pack Qty: 10000; Subcategory: Resistors; RoHS - Mouser: E; Minimum Order Quantity: 1; Reeling: True; ComponentLink1URL: https://www.mouser.com/datasheet/2/447/PYu-RC_Group_51_RoHS_L_10-1664068.pdf; ComponentLink1Description: https://www.mouser.com/datasheet/2/447/PYu-RC_Group_51_RoHS_L_10-1664068.pdf; Supplier Part Number 1: 603-RC0402FR-072K2L
R121 R127 R131 R145 R150 R154 R168 R173 R177 R186 R191 = RC1210FR-07150RL: RES 1210 (3225) 150.0R 1% 0.500W 200V Thick Film; Manufacturer: Yageo; Resistance: 150R; Temperature Coefficient: 100ppm/°C; Supplier 1: Mouser; Manufacturer Part Number: RC1210FR-07150RL; RoHS: Yes; Category: Chip SMD Resistors; Stock 1: 69300; Pricing 1: 1=0,12, 10=0,035, 50=0,035, 100=0,022, 1000=0,015, 10000=0,014 (USD); Mount: Surface Mount; Case/Package: 1210; Case Code (Imperial): 1210; Case Code (Metric): 3225; Contact Plating: Tin,Matte; Min Operating Temperature: -55°C; Max Operating Temperature: 155°C; Packaging: Tape and Reel; Tolerance: 1%; Voltage Rating: 200V; Termination: SMD/SMT; Number of Terminations: 2; Max Power Dissipation: 500mW; Features: Moisture Resistant; Series: RC; Technology: THICK FILM; Length: 3.1mm; Width: 2.6mm; Height: 0.5mm; Depth: 2.6mm; RoHS Compliant: Yes; ComponentLink1URL: https://datasheet.ciiva.com/11809/0900766b8079c86c-11809577.pdf?src-supplier=Rs; ComponentLink1Description: https://datasheet.ciiva.com/11809/0900766b8079c86c-11809577.pdf?src-supplier=Rs; ComponentLink2URL: https://datasheet.ciiva.com/8887/pyu-rc1210-51-rohs-l-4-8887352.pdf?src-supplier=Avnet; ComponentLink2Description: https://datasheet.ciiva.com/8887/pyu-rc1210-51-rohs-l-4-8887352.pdf?src-supplier=Avnet; Supplier Part Number 1: 603-RC1210FR-07150RL
R122 R128 R132 R146 R151 = RC0402FR-07133KL: RES 0402 (1005) 133.0k 1% 0.0625W 50V Thick Film; Manufacturer: Yageo; Resistance: 133kR; Power Rating: 62.5mW; Temperature Coefficient: 100ppm/°C; Max Power Dissipation: 63mW; Supplier 1: Mouser; Manufacturer Part Number: RC0402FR-07133KL; RoHS: Yes; Category: Chip SMD Resistors; Stock 1: 76079; Pricing 1: 1=0,10000, 10=0,01200, 50=0,01200, 100=0,00500, 1000=0,00300, 2500=0,00200, 10000=0,00100 (USD); Case/Package: 0402; Case Code (Imperial): 0402; Case Code (Metric): 1005; Weight: 2.3E-05oz; Contact Plating: Tin,Matte; Min Operating Temperature: -55°C; Max Operating Temperature: 155°C; Tolerance: 1%; Voltage Rating: 50V; Packaging: Tape and Reel; Resistor Type: Thick Film; Termination: SMD/SMT; Number of Terminations: 2; Voltage Rating (DC): 50V; Working Voltage: 50V; Features: Moisture Resistant; Series: RC; Construction: Rectangular; Technology: THICK FILM; Length: 1mm; Width: 0.5mm; Height: 0.016inch; Depth: 0.5mm; Military Standard: Not; Lead Free: Lead Free; RoHS Compliant: Yes; ComponentLink1URL: https://datasheet.ciiva.com/8887/pyu-rc0402-51-rohs-l-6-8887454.pdf?src-supplier=Avnet; ComponentLink1Description: https://datasheet.ciiva.com/8887/pyu-rc0402-51-rohs-l-6-8887454.pdf?src-supplier=Avnet; ComponentLink2URL: https://datasheet.ciiva.com/16742/pyu-rc0402-51-rohs-l-6-r-16742778.pdf?src-supplier=Future+Electronics; ComponentLink2Description: https://datasheet.ciiva.com/16742/pyu-rc0402-51-rohs-l-6-r-16742778.pdf?src-supplier=Future+Electronics; Supplier Part Number 1: 603-RC0402FR-07133KL
R152 R165 R171 R175 R183 R189 R197 = RC0402FR-0734K8L: RES 0402 (1005) 34.8k 1% 0.0625W 50V Thick Film; Manufacturer: Yageo; Power Rating: 62.5 mW (1/16 W); Resistance: 34.8 kOhms; Temperature Coefficient: 100 PPM / C; Supplier 1: Mouser; Manufacturer Part Number: RC0402FR-0734K8L; RoHS: RoHS Compliant By Exemption; Category: Thick Film Resistors - SMD; Stock 1: 26065; Pricing 1: 1=0.085, 10=0.010, 100=0.003, 10000=0.003 (EUR); Application: High Reliability; Features: -; Height: 0.35 mm; Length: 1 mm; Package / Case: -; Packaging: Cut Tape; Product: Thick Film Resistors SMD; Series: RC; Technology: Thick Film; Termination Style: SMD/SMT; Tolerance: 1 %; Type: General Purpose; Voltage Rating: 50 V; Width: 0.5 mm; Brand: Yageo; Mounting Style: PCB Mount; Case Code - in: 0402; Case Code - mm: 1005; Maximum Operating Temperature: + 155 C; Minimum Operating Temperature: - 55 C; Product Type: Thick Film Resistors; Standard Pack Qty: 10000; Subcategory: Resistors; RoHS - Mouser: E; Minimum Order Quantity: 1; Reeling: True; ComponentLink1URL: https://www.mouser.com/datasheet/2/447/PYu_RC_Group_51_RoHS_L_10-1664068.pdf; ComponentLink1Description: https://www.mouser.com/datasheet/2/447/PYu_RC_Group_51_RoHS_L_10-1664068.pdf; Supplier Part Number 1: 603-RC0402FR-0734K8L
R153 R166 R172 R176 R184 R190 R198 = RC0402FR-071KL: RES 0402 (1005) 1.00k 1% 0.0625W 50V Thick Film; Manufacturer: Yageo; Power Rating: 62.5 mW, 125 mW; Resistance: 1 kOhms; Temperature Coefficient: 100 PPM / C; Supplier 1: Mouser; Manufacturer Part Number: RC0402FR-071KL; RoHS: RoHS Compliant; Category: Thick Film Resistors - SMD; Stock 1: 18776448; Pricing 1: 1=0.090, 10=0.011, 100=0.004, 1000=0.003, 10000=0.003 (EUR); Application: High Reliability; Features: -; Height: 0.35 mm; Length: 1 mm; Package / Case: -; Packaging: Cut Tape; Product: Thick Film Resistors SMD; Series: RC; Technology: Thick Film; Termination Style: SMD/SMT; Tolerance: 1 %; Type: General Purpose; Voltage Rating: 50 V; Width: 0.5 mm; Brand: Yageo; Mounting Style: PCB Mount; Case Code - in: 0402; Case Code - mm: 1005; Maximum Operating Temperature: + 155 C; Minimum Operating Temperature: - 55 C; Product Type: Thick Film Resistors; Standard Pack Qty: 10000; Subcategory: Resistors; RoHS - Mouser: Y; Minimum Order Quantity: 1; Reeling: True; ComponentLink1URL: https://www.mouser.com/datasheet/2/447/PYu-RC_Group_51_RoHS_L_10-1664068.pdf; ComponentLink1Description: https://www.mouser.com/datasheet/2/447/PYu-RC_Group_51_RoHS_L_10-1664068.pdf; Supplier Part Number 1: 603-RC0402FR-071KL
R155 R169 R174 R178 R187 R192 = RC0402FR-0710KL: as R50 on sheet bolid-rs485-usb-sd; Supplier 1: Mouser; Manufacturer Part Number: RC0402FR-0710KL; RoHS: RoHS Compliant; Category: Thick Film Resistors - SMD; Stock 1: 20942447; Pricing 1: 1=0.090, 10=0.011, 100=0.004, 1000=0.003, 10000=0.003 (EUR); Application: High Reliability; Features: -; Height: 0.35 mm; Length: 1 mm; Package / Case: -; Packaging: Cut Tape; Product: Thick Film Resistors SMD; Series: RC; Technology: Thick Film; Termination Style: SMD/SMT; Tolerance: 1 %; Type: General Purpose; Voltage Rating: 50 V; Width: 0.5 mm; Brand: Yageo; Mounting Style: PCB Mount; Case Code - in: 0402; Case Code - mm: 1005; Maximum Operating Temperature: + 155 C; Minimum Operating Temperature: - 55 C; Product Type: Thick Film Resistors; Standard Pack Qty: 10000; Subcategory: Resistors; RoHS - Mouser: Y; Minimum Order Quantity: 1; Reeling: True; ComponentLink1URL: https://www.mouser.com/datasheet/2/447/PYu-RC_Group_51_RoHS_L_10-1664068.pdf; ComponentLink1Description: https://www.mouser.com/datasheet/2/447/PYu-RC_Group_51_RoHS_L_10-1664068.pdf; Supplier Part Number 1: 603-RC0402FR-0710KL
U33 U34 U37 U40 U41 U43 = BAS70BRW-7-F: BAS70BRW Series 70 V 100 mA Surface Mount Schottky Barrier Diode Arrays SOT-363; Manufacturer: Diodes; Forward Current: 70mA; Max Reverse Current: 100nA; Forward Voltage: 1V; Max Power Dissipation: 200mW; Reverse Recovery Time: 5ns; Max Repetitive Reverse Voltage (Vrrm): 70V; Peak Non-Repetitive Surge Current: 100mA; Capacitance: 2pF; Supplier 1: Mouser; Manufacturer Part Number: BAS70BRW-7-F; RoHS: Yes; Category: Schottky Diodes; Stock 1: 23365; Pricing 1: 1=0,62000, 10=0,53000, 50=0,53000, 100=0,39600, 1000=0,24100, 10000=0,19700 (USD); Mount: Surface Mount; Case/Package: SOT-363; Number of Pins: 6; Weight: 0.000212oz; Contact Plating: Tin,Matte; Min Operating Temperature: -55°C; Max Operating Temperature: 125°C; Package Quantity: 3000; Packaging: Tape and Reel; Average Rectified Current: 70mA; Power Dissipation: 200mW; Termination: SMD/SMT; Max Forward Surge Current (Ifsm): 100mA; Current Rating: 70mA; Power Rating: 200mW; Voltage Rating (DC): 70V; Max Reverse Voltage (DC): 70V; Series: -; Length: 2.2mm; Width: 1.35mm; Height: 1mm; Radiation Hardening: No; Lead Free: Lead Free; RoHS Compliant: Yes; ComponentLink1URL: https://datasheet.ciiva.com/26949/getdatasheetpartid-202320-26949402.pdf?src-supplier=Verical; ComponentLink1Description: https://datasheet.ciiva.com/26949/getdatasheetpartid-202320-26949402.pdf?src-supplier=Verical; Supplier Part Number 1: 621-BAS70BRW-7-F